# Altium schematic sheet vertical_counter.SchDoc
size A4; SheetNumber: 3; SheetTotal: 4
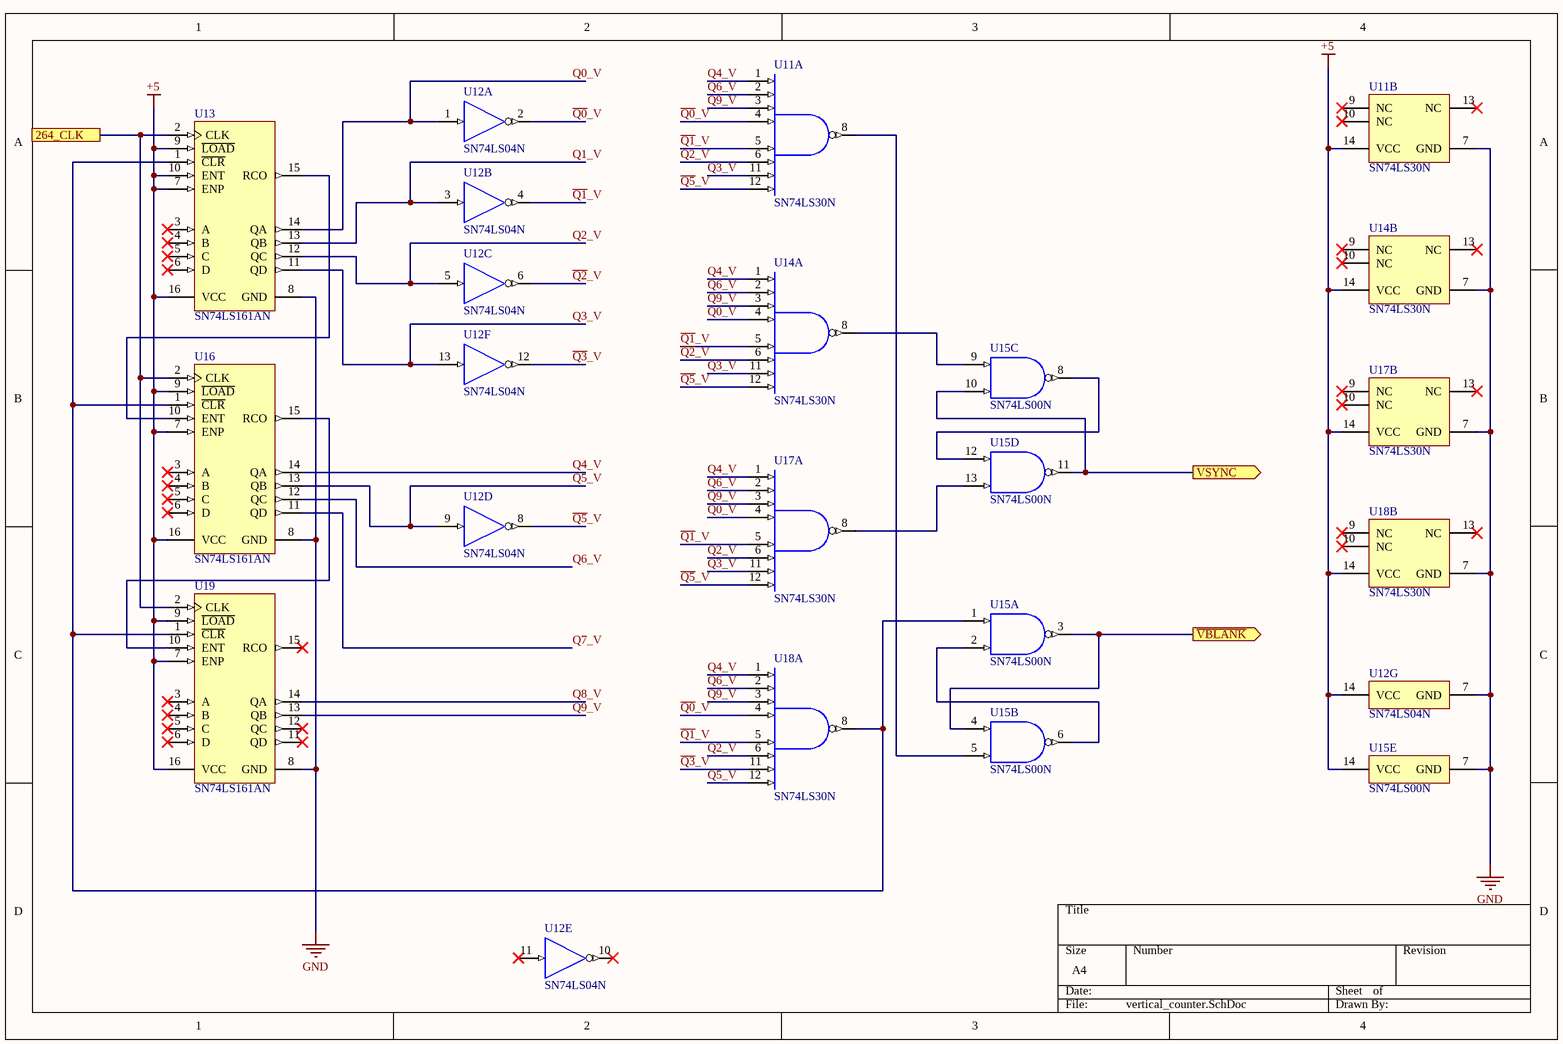
[diagram p0: vertical_counter.SchDoc]

## Parts
U11  SN74LS30N  [N0014A]  (parts A,B of 2)
U12  SN74LS04N  [N0014A]  (parts A,B,C,D,E,F,G of 7)
U13  SN74LS161AN  [N0016A]
U14  SN74LS30N  [N0014A]  (parts A,B of 2)
U15  SN74LS00N  [N0014A]  (parts A,B,C,D,E of 5)
U16  SN74LS161AN  [N0016A]
U17  SN74LS30N  [N0014A]  (parts A,B of 2)
U18  SN74LS30N  [N0014A]  (parts A,B of 2)
U19  SN74LS161AN  [N0016A]

## Ports
264_CLK, VSYNC (out), ~{VBLANK} (out)

## Nets
+5: U11.14(VCC) U12.14(VCC) U13.7(ENP) U13.9(~{LOAD}) U13.10(ENT) U13.16(VCC) U14.14(VCC) U15.14(VCC) U16.7(ENP) U16.9(~{LOAD}) U16.16(VCC) U17.14(VCC) U18.14(VCC) U19.7(ENP) U19.9(~{LOAD}) U19.16(VCC)
GND: U11.7(GND) U12.7(GND) U13.8(GND) U14.7(GND) U15.7(GND) U16.8(GND) U17.7(GND) U18.7(GND) U19.8(GND)
264_CLK: U13.2(CLK) U16.2(CLK) U19.2(CLK) ; port 264_CLK
Q0_V: U12.1(1A) U13.14(QA) U14.4(D) U17.4(D)
Q1_V: U12.3(2A) U13.13(QB)
Q2_V: U12.5(3A) U13.12(QC) U17.6(F) U18.6(F)
Q3_V: U11.11(G) U12.13(6A) U13.11(QD) U14.11(G) U17.11(G)
Q4_V: U11.1(A) U14.1(A) U16.14(QA) U17.1(A) U18.1(A)
Q5_V: U12.9(4A) U16.13(QB) U18.12(H)
Q6_V: U11.2(B) U14.2(B) U16.12(QC) U17.2(B) U18.2(B)
Q7_V: U16.11(QD)
Q8_V: U19.14(QA)
Q9_V: U11.3(C) U14.3(C) U17.3(C) U18.3(C) U19.13(QB)
~{Q0}_V: U11.4(D) U12.2(~{1Y}) U18.4(D)
~{Q1}_V: U11.5(E) U12.4(~{2Y}) U14.5(E) U17.5(E) U18.5(E)
~{Q2}_V: U11.6(F) U12.6(~{3Y}) U14.6(F)
~{Q3}_V: U12.12(~{6Y}) U18.11(G)
~{Q5}_V: U11.12(H) U12.8(~{4Y}) U14.12(H) U17.12(H)
~{VBLANK}: U15.3(1Y) U15.4(2A) ; port ~{VBLANK}
VSYNC: U15.10(3B) U15.11(4Y) ; port VSYNC
NetU11_8: U11.8(~{Y}) U15.5(2B)
NetU13_1: U13.1(~{CLR}) U15.1(1A) U16.1(~{CLR}) U18.8(~{Y}) U19.1(~{CLR})
NetU13_15: U13.15(RCO) U16.10(ENT)
NetU14_8: U14.8(~{Y}) U15.9(3A)
NetU15_2: U15.2(1B) U15.6(2Y)
NetU15_8: U15.8(3Y) U15.12(4A)
NetU15_13: U15.13(4B) U17.8(~{Y})
NetU16_15: U16.15(RCO) U19.10(ENT)

Not connected (* = marked no-connect by the designer): U11 9(NC)* 10(NC)* 13(NC)*; U12 10(~{5Y})* 11(5A)*; U13 3(A)* 4(B)* 5(C)* 6(D)*; U14 9(NC)* 10(NC)* 13(NC)*; U16 3(A)* 4(B)* 5(C)* 6(D)*; U17 9(NC)* 10(NC)* 13(NC)*; U18 9(NC)* 10(NC)* 13(NC)*; U19 3(A)* 4(B)* 5(C)* 6(D)* 11(QD)* 12(QC)* 15(RCO)*

## Library data of the parts
U11 U14 U17 U18 = CMP-1627-00459-2: 8-input positive-NAND gates, N0014A, TUBE; Manufacturer: Texas Instruments; ICC @ Nom Voltage(Max)(mA): 0.006; Rating: Catalog; VCC(Min)(V): 4.75; Voltage(Nom)(V): 5; Input Type: TTL; F @ Nom Voltage(Max)(Mhz): 35; tpd @ Nom Voltage(Max)(ns): 22; Bits(#): 1; Technology Family: LS; Output Drive (IOL/IOH)(Max)(mA): 0.4/-16; Schmitt Trigger: No; VCC(Max)(V): 5.25; PackageReference: N0014A; Code_JEDEC: MS-001; Generic Part Number: SN74LS30; Output Type: TTL; DatasheetVersion: SDLS099; Operating Temperature Range(C): 0 to 70
U12 = CMP-1615-00911-2: Hex inverters, N0014A, TUBE; Manufacturer: Texas Instruments; Output Drive (IOL/IOH)(Max)(mA): -0.4/8; Schmitt Trigger: No; F @ Nom Voltage(Max)(Mhz): 35; Voltage(Nom)(V): 5; Technology Family: LS; Input Type: TTL; Output Type: CMOS; Bits(#): 6; VCC(Max)(V): 5.25; ICC @ Nom Voltage(Max)(mA): 0.033; Rating: Catalog; VCC(Min)(V): 4.75; tpd @ Nom Voltage(Max)(ns): 22; Operating Temperature Range(C): 0 to 70; DatasheetVersion: SDLS029C; Generic Part Number: SN74LS04; Code_JEDEC: MS-001; PackageReference: N0014A
U13 U16 U19 = CMP-1623-00512-2: Synchronous 4-Bit Binary Counters, N0016A, TUBE; Manufacturer: Texas Instruments; VCC(Max)(V): 5.25; tpd @ Nom Voltage(Max)(ns): 35; Output Type: CMOS; Input Type: TTL; ICC @ Nom Voltage(Max)(mA): 32; VCC(Min)(V): 4.75; Technology Family: LS; Voltage(Nom)(V): 5; Output Drive (IOL/IOH)(Max)(mA): 8/-0.4; Inputs: 1; Schmitt Trigger: No; Rating: Catalog; Bits(#): 4; Type: Binary; Generic Part Number: SN74LS161A; Code_JEDEC: MS-001; F @ Nom Voltage(Max)(Mhz): 35; Function: Counter; PackageReference: N0016A; DatasheetVersion: SDLS060; Operating Temperature Range(C): 0 to 70
U15 = CMP-1627-00476-2: Quad 2-input positive-NAND gates, N0014A, TUBE; Manufacturer: Texas Instruments; VCC(Min)(V): 4.75; F @ Nom Voltage(Max)(Mhz): 35; Voltage(Nom)(V): 5; Rating: Catalog; tpd @ Nom Voltage(Max)(ns): 22; Output Type: TTL; Schmitt Trigger: No; Output Drive (IOL/IOH)(Max)(mA): 0.4/-16; Technology Family: LS; ICC @ Nom Voltage(Max)(mA): 0.022; VCC(Max)(V): 5.25; Bits(#): 4; Code_JEDEC: MS-001; Generic Part Number: SN74LS00; Input Type: TTL; Operating Temperature Range(C): 0 to 70; PackageReference: N0014A; DatasheetVersion: SDLS025B